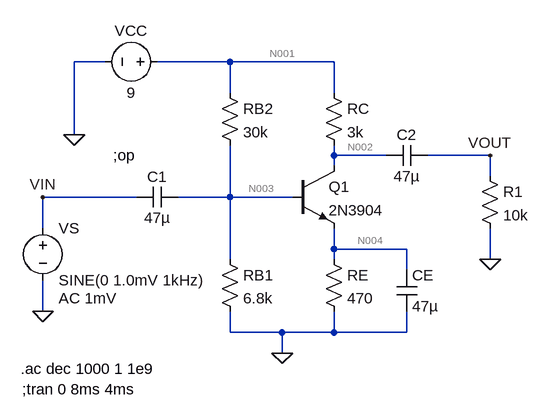
[diagram p0: schematic Prelab2-schematic1.asc]
Prelab2-schematic1.asc, the LTspice schematic file:
Version 4
SHEET 1 880 680
WIRE -144 -64 -192 -64
WIRE 48 -64 -64 -64
WIRE 208 -64 48 -64
WIRE 48 -16 48 -64
WIRE 208 -16 208 -64
WIRE -192 48 -192 -64
WIRE 208 80 208 64
WIRE 288 80 208 80
WIRE 448 80 352 80
WIRE 208 96 208 80
WIRE 448 112 448 80
WIRE -96 144 -240 144
WIRE 48 144 48 64
WIRE 48 144 -32 144
WIRE 144 144 48 144
WIRE -240 192 -240 144
WIRE 208 224 208 192
WIRE 320 224 208 224
WIRE 48 240 48 144
WIRE 208 240 208 224
WIRE 448 240 448 192
WIRE 320 256 320 224
WIRE -240 320 -240 272
WIRE 48 352 48 320
WIRE 128 352 48 352
WIRE 208 352 208 320
WIRE 208 352 128 352
WIRE 320 352 320 320
WIRE 320 352 208 352
WIRE 128 384 128 352
FLAG -192 48 0
FLAG 128 384 0
FLAG 448 240 0
FLAG -240 320 0
FLAG 448 80 VOUT
FLAG -240 144 VIN
SYMBOL npn 144 96 R0
SYMATTR InstName Q1
SYMATTR Value 2N3904
SYMBOL res 192 224 R0
SYMATTR InstName RE
SYMATTR Value 470
SYMBOL res 192 -32 R0
SYMATTR InstName RC
SYMATTR Value 3k
SYMBOL res 32 -32 R0
SYMATTR InstName RB2
SYMATTR Value 30k
SYMBOL res 32 224 R0
SYMATTR InstName RB1
SYMATTR Value 6.8k
SYMBOL voltage -48 -64 R90
WINDOW 0 -32 56 VBottom 2
WINDOW 3 32 56 VTop 2
WINDOW 123 0 0 Left 2
WINDOW 39 0 0 Left 2
SYMATTR InstName VCC
SYMATTR Value 9
SYMBOL res 432 96 R0
SYMATTR InstName R1
SYMATTR Value 10k
SYMBOL voltage -240 176 R0
WINDOW 123 24 124 Left 2
WINDOW 39 0 0 Left 2
SYMATTR InstName VS
SYMATTR Value SINE(0 1.0mV 1kHz)
SYMATTR Value2 AC 1mV
SYMBOL cap 304 256 R0
SYMATTR InstName CE
SYMATTR Value 47µ
SYMBOL cap 352 64 R90
WINDOW 0 0 32 VBottom 2
WINDOW 3 32 32 VTop 2
SYMATTR InstName C2
SYMATTR Value 47µ
SYMBOL cap -32 128 R90
WINDOW 0 0 32 VBottom 2
WINDOW 3 32 32 VTop 2
SYMATTR InstName C1
SYMATTR Value 47µ
TEXT -132 80 Left 2 !;op
TEXT -274 408 Left 2 !.ac dec 1000 1 1e9
TEXT -272 440 Left 2 !;tran 0 8ms 4ms

The netlist it stands for:
* Prelab2-schematic1.asc
Q1 N002 N003 N004 0 2N3904
RE N004 0 470
RC N001 N002 3k
RB2 N001 N003 30k
RB1 N003 0 6.8k
VCC N001 0 9
R1 VOUT 0 10k
VS VIN 0 SINE(0 1.0mV 1kHz) AC 1mV
CE N004 0 47µ
C2 VOUT N002 47µ
C1 N003 VIN 47µ
.model NPN NPN
.model PNP PNP
.lib standard.bjt
;op
.ac dec 1000 1 1e9
;tran 0 8ms 4ms
.backanno
.end

* Results of the author's LTspice run, read from the files saved beside the schematic
* Operating Point, zero values left out:
*   V(n002) = 2.94 V
*   V(n003) = 1.626 V
*   V(n004) = 952.6 mV
*   V(n001) = 9 V
*   Ic(Q1) = 2.02 mA
*   Ib(Q1) = 6.679 µA
*   Ie(Q1) = -2.027 mA
*   I(Rb1) = 239.1 µA
*   I(Rb2) = 245.8 µA
*   I(Rc) = 2.02 mA
*   I(Re) = 2.027 mA
*   I(Vcc) = -2.266 mA
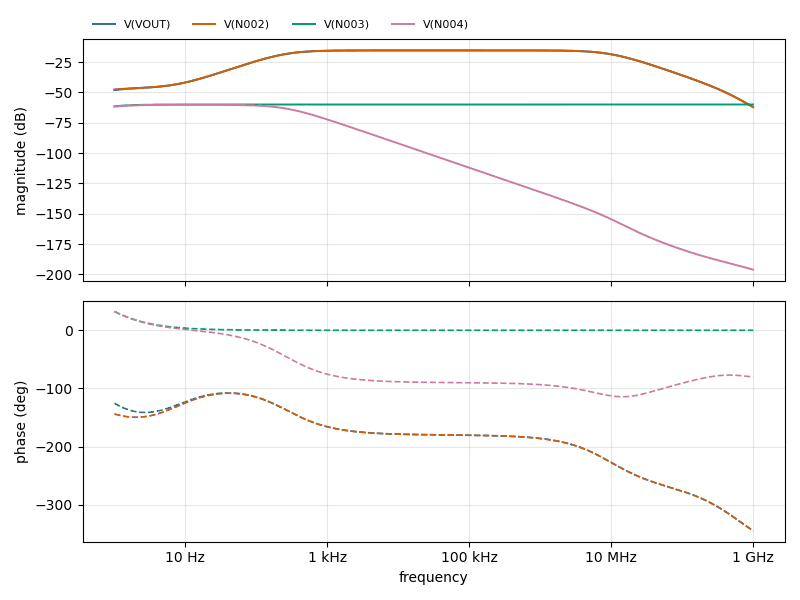
[diagram p1: AC Analysis of Prelab2-schematic1.asc, plotted from the saved traces]
* AC Analysis, 1 run:
*   V(VOUT): -48.15 dB at 1 Hz, -62.13 dB at 1 GHz, peak -15.43 dB at 49.77 kHz, 3 dB below the peak at 257.2 Hz and 9.619 MHz
*   V(N002): -47.68 dB at 1 Hz, -62.13 dB at 1 GHz, peak -15.43 dB at 49.77 kHz, 3 dB below the peak at 257.2 Hz and 9.619 MHz
*   V(N003): -61.49 dB at 1 Hz, -60.00 dB at 1 GHz, peak -60.00 dB at 1 GHz
*   V(N004): -61.74 dB at 1 Hz, -196.13 dB at 1 GHz, peak -60.30 dB at 12.76 Hz, 3 dB below the peak at 258.6 Hz